# Altium schematic sheet 03 - Power.SchDoc
size A4; DocumentNumber: 2; SheetNumber: 2; SheetTotal: 4
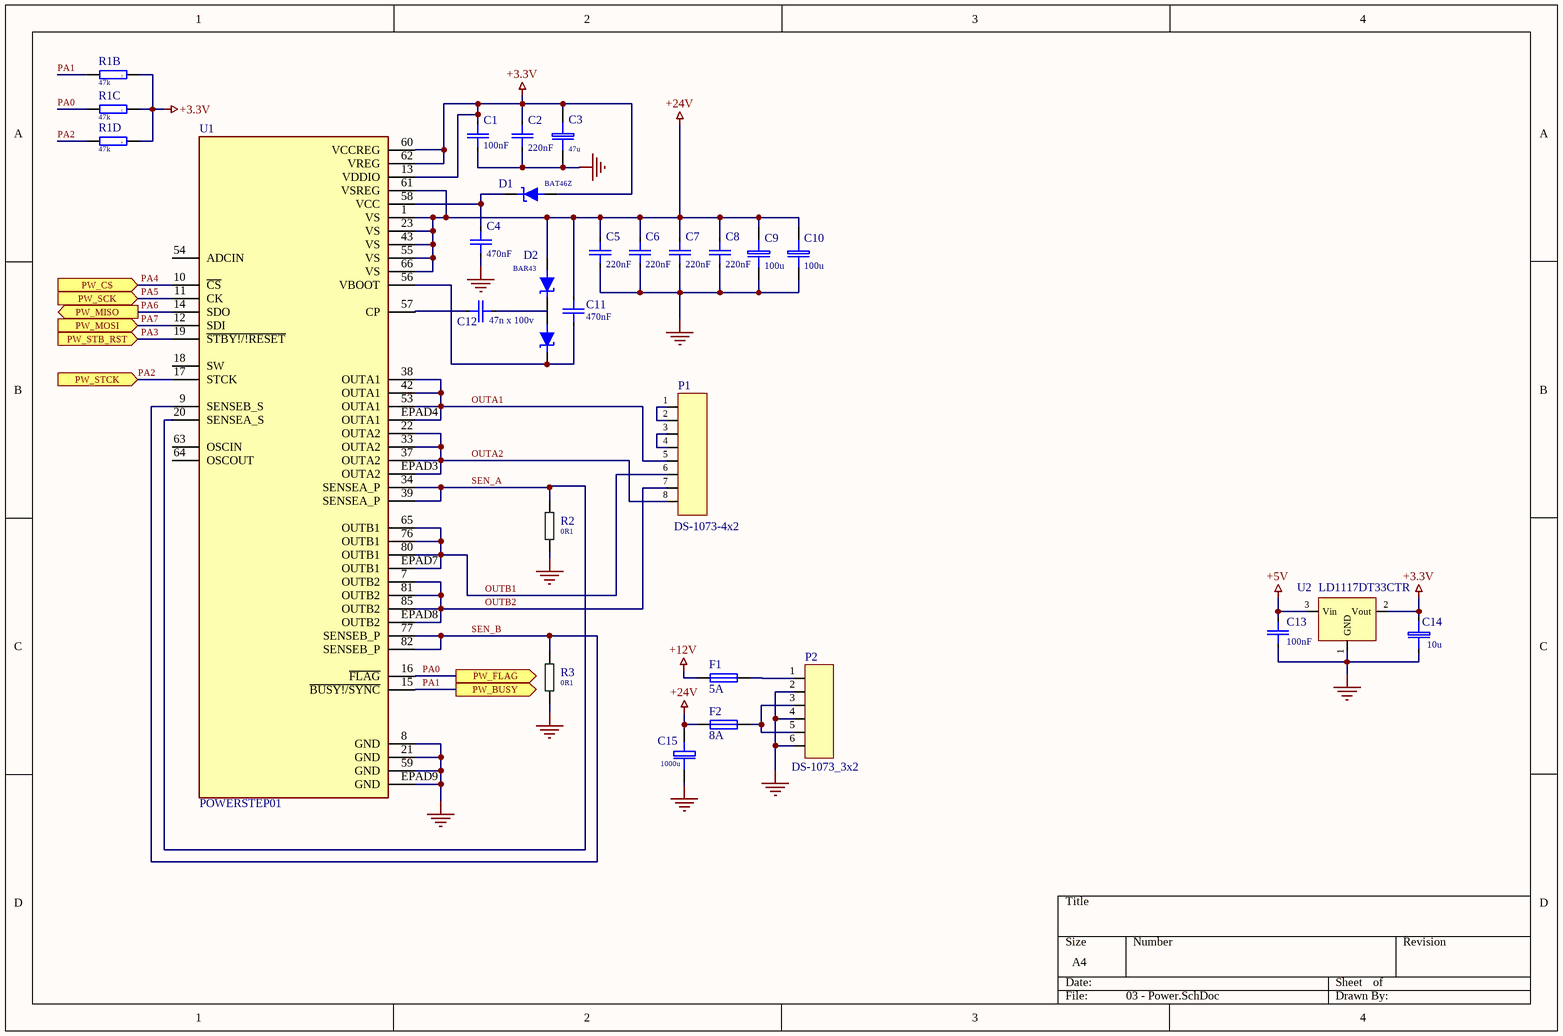
[diagram p0: 03 - Power.SchDoc]

## Parts
C1  100nF  [CAP: 0805]
C2  220nF  [CAP: 0805]
C3  47u  [EL SMD Case C D5x5.3 h5.4(0505)]
C4  470nF  [CAP: 0805]
C5  220nF  [CAP: 0805]
C6  220nF  [CAP: 0805]
C7  220nF  [CAP: 0805]
C8  220nF  [CAP: 0805]
C9  100u  [EL SMD Case G D10x10.3 h10.2(1010)]
C10  100u  [EL SMD Case G D10x10.3 h10.2(1010)]
C11  470nF  [CAP: 0805]
C12  value 47n x 100v  [CAP: 0805]
C13  100nF  [CAP: 0805]
C14  10u  [EL Case A (3216-18)]
C15  1000u  [El-d13-h21-F5.08]
D1  BAT46Z  [SOD123]
D2  BAR43  [SOT23]
F1  5A  [Littelfuse 0451/453]
F2  8A  [Littelfuse 0451/453]
P1  DS-1073-4x2  [DS-1073-4x2]
P2  DS-1073_3x2  [DS-1073-2x3]
R1  47k  [RM4x0603]  (parts B,C,D of 4)
R2  0R1  [R2512]
R3  0R1  [R2512]
U1  POWERSTEP01  [POWERSTEP01]
U2  LD1117DT33CTR  [DPAK]

## Ports
PW_BUSY (out), PW_CS (in), PW_FLAG (out), PW_MISO (out), PW_MOSI (in), PW_SCK (in), PW_STB_RST (in), PW_STCK (in)

## Nets
+3.3V: C1.2 C2.1 C3.1(+) C14.1 D1.1(A) R1.2 R1.3 R1.4 U1.13(VDDIO) U1.60(VCCREG) U1.62(VREG) U2.2(Vout)
+5V: C13.2 U2.3(Vin)
+12V: F1.1
+24V: C5.1 C6.1 C7.1 C8.1 C9.1 C10.1 C11.1 C15.1 D2.1 F2.1 U1.1(VS) U1.23(VS) U1.43(VS) U1.55(VS) U1.61(VSREG) U1.66(VS)
GND: C1.1 C2.2 C3.2(-) C4.2 C5.2 C6.2 C7.2 C8.2 C9.2 C10.2 C13.1 C14.2 C15.2 P2.2 P2.4 P2.6 R2.1 R3.1 U1.8(GND) U1.21(GND) U1.59(GND) U1.EPAD9(GND) U2.1(GND)
OUTA1: P1.5 U1.38(OUTA1) U1.42(OUTA1) U1.53(OUTA1) U1.EPAD4(OUTA1)
OUTA2: P1.8 U1.22(OUTA2) U1.33(OUTA2) U1.37(OUTA2) U1.EPAD3(OUTA2)
OUTB1: P1.6 U1.65(OUTB1) U1.76(OUTB1) U1.80(OUTB1) U1.EPAD7(OUTB1)
OUTB2: P1.7 U1.7(OUTB2) U1.81(OUTB2) U1.85(OUTB2) U1.EPAD8(OUTB2)
PA0: R1.6 U1.16(~{FLAG}) ; port PW_FLAG
PA1: R1.7 U1.15(~{BUSY!/SYNC}) ; port PW_BUSY
PA2: R1.5 U1.17(STCK) ; port PW_STCK
PA3: U1.19(~{STBY!/!RESET}) ; port PW_STB_RST
PA4: U1.10(~{CS}) ; port PW_CS
PA5: U1.11(CK) ; port PW_SCK
PA6: U1.14(SDO) ; port PW_MISO
PA7: U1.12(SDI) ; port PW_MOSI
SEN_A: R2.2 U1.20(SENSEA_S) U1.34(SENSEA_P) U1.39(SENSEA_P)
SEN_B: R3.2 U1.9(SENSEB_S) U1.77(SENSEB_P) U1.82(SENSEB_P)
NetC4_1: C4.1 D1.2(C) U1.58(VCC)
NetC11_2: C11.2 D2.2 U1.56(VBOOT)
NetC12_1: C12.1 U1.57(CP)
NetC12_2: C12.2 D2.3
NetF1_2: F1.2 P2.1
NetF2_2: F2.2 P2.3 P2.5
NetP1_1: P1.1 P1.2
NetP1_3: P1.3 P1.4

Not connected (* = marked no-connect by the designer): U1 18(SW) 54(ADCIN) 63(OSCIN) 64(OSCOUT)

## Library data of the parts
C1 C2 C4-C8 C11-C13 = C-0805: SMD-0805; Price: 0.014
  C1 C13: Value: 100nF
  C2 C5-C8: Value: 220nF; ComponentLink1Description: New link; ComponentLink1URL: https://www.electronshik.ru/item/YAG/CC0805KKX7R9BB224
  C4 C11: Value: 470nF; ComponentLink1Description: New link; ComponentLink1URL: https://www.electronshik.ru/item/MUR/GRM21BR71H474KA88L
  C12: ComponentLink1Description: New link; ComponentLink1URL: https://www.electronshik.ru/item/YAG/CC0805KKX7R0BB473
C3 = EL 10u/50V: EL 50V SMD Case C D5x5.3 h5.4; Price: 0.014; Value: 47u
C9 C10 = EL 100u/35V: EL 35V SMD Case G D10x10.3h10.5; Price: 0.014; Value: 100u; ComponentLink1Description: New link; ComponentLink1URL: https://www.chipdip.ru/product0/9000565738
C14 = EL 10u/16V Tant.: El Case A (2012-12); Price: 0.22; Value: 10u; ComponentLink1Description: New link; ComponentLink1URL: https://www.electronshik.ru/item/VISHAY/293D106X0016A2TE3; ComponentLink2Description: New link; ComponentLink2URL: https://www.chipdip.ru/product0/868717967
C15 = 1000u-35V 105F: 35V 105C 34m 1.8A 5000h; Price: 0.42; Value: 1000u
D1 = 1N6263: SMD-SOT123 60V 15mA 2.2pF 1nS; Price: 0.07; ComponentLink1Description: New link; ComponentLink1URL: https://www.electronshik.ru/item/ST/BAT46ZFILM
D2 = BAT54S: SMD-SOT23 30V 0.2A 5nS 10pF; Price: 0.08; ComponentLink1Description: New link; ComponentLink1URL: https://www.electronshik.ru/item/ST/BAR43FILM
F1 F2 = Littelfuse 0451: 0451003; Price: 0.3; ComponentLink1Description: New link; ComponentLink1URL: https://www.electronshik.ru/item/LTL/0451003.MRL
R1 = 4RM-0603: SMD 4RM-0603 1\16W 5%; Price: 0.07; Value: 47k; ComponentLink1Description: New link; ComponentLink1URL: https://www.electronshik.ru/item/BOURNS/CAT16-473J4LF
R2 R3 = R-2512: SMD 2512 1W 5% 200V; Price: 0.087; Value: 0R1; ComponentLink1Description: New link; ComponentLink1URL: https://www.electronshik.ru/item/BOURNS/CRA2512-FZ-R100ELF
U1 = POWERSTEP01: Bipolar Motor Driver Power MOSFET SPI 89-VFQFPN _11x14_; MF: STMicroelectronics; MP: POWERSTEP01; Availability: Unavailable; Package: PowerVFQFN-89 STMicroelectronics; Value: *; Price: None; ComponentLink1Description: Buy; ComponentLink1URL: https://www.electronshik.ru/item/ST/POWERSTEP01; ComponentLink2Description: Module; ComponentLink2URL: https://www.st.com/resource/en/user_manual/dm00206777-getting-started-with-the-high-power-stepper-motor-driver-expansion-board-based-on-powerstep01-for-stm32-nucleo-stmicroelectronics.pdf; ComponentLink3Description: Software; ComponentLink3URL: https://www.st.com/resource/en/user_manual/dm00207127-getting-started-with-the-xcubespn3-high-power-stepper-motor-driver-software-expansion-for-stm32cube-stmicroelectronics.pdf; ComponentLink4Description: Datasheet; ComponentLink4URL: https://www.st.com/resource/en/datasheet/powerstep01.pdf
P1 = DS-1073-4x2: ComponentLink1Description: New link; ComponentLink1URL: https://www.chipdip.ru/product/ds1073-01-2x4-mr2t6-mf2x4mra
P2 = DS-1073_3x2: ComponentLink1Description: New link; ComponentLink1URL: https://www.chipdip.ru/product/ds1073-01-2x3-mr2t6-mf2x3mra
U2 = LD1117DT33CTR: ComponentLink1Description: New link; ComponentLink1URL: https://www.chipdip.ru/product/ld1117dt33ctr